# EAGLE schematic Select-Fire Rapidstrike (EAGLE 9.4.2)

## Sheet 1 of 2
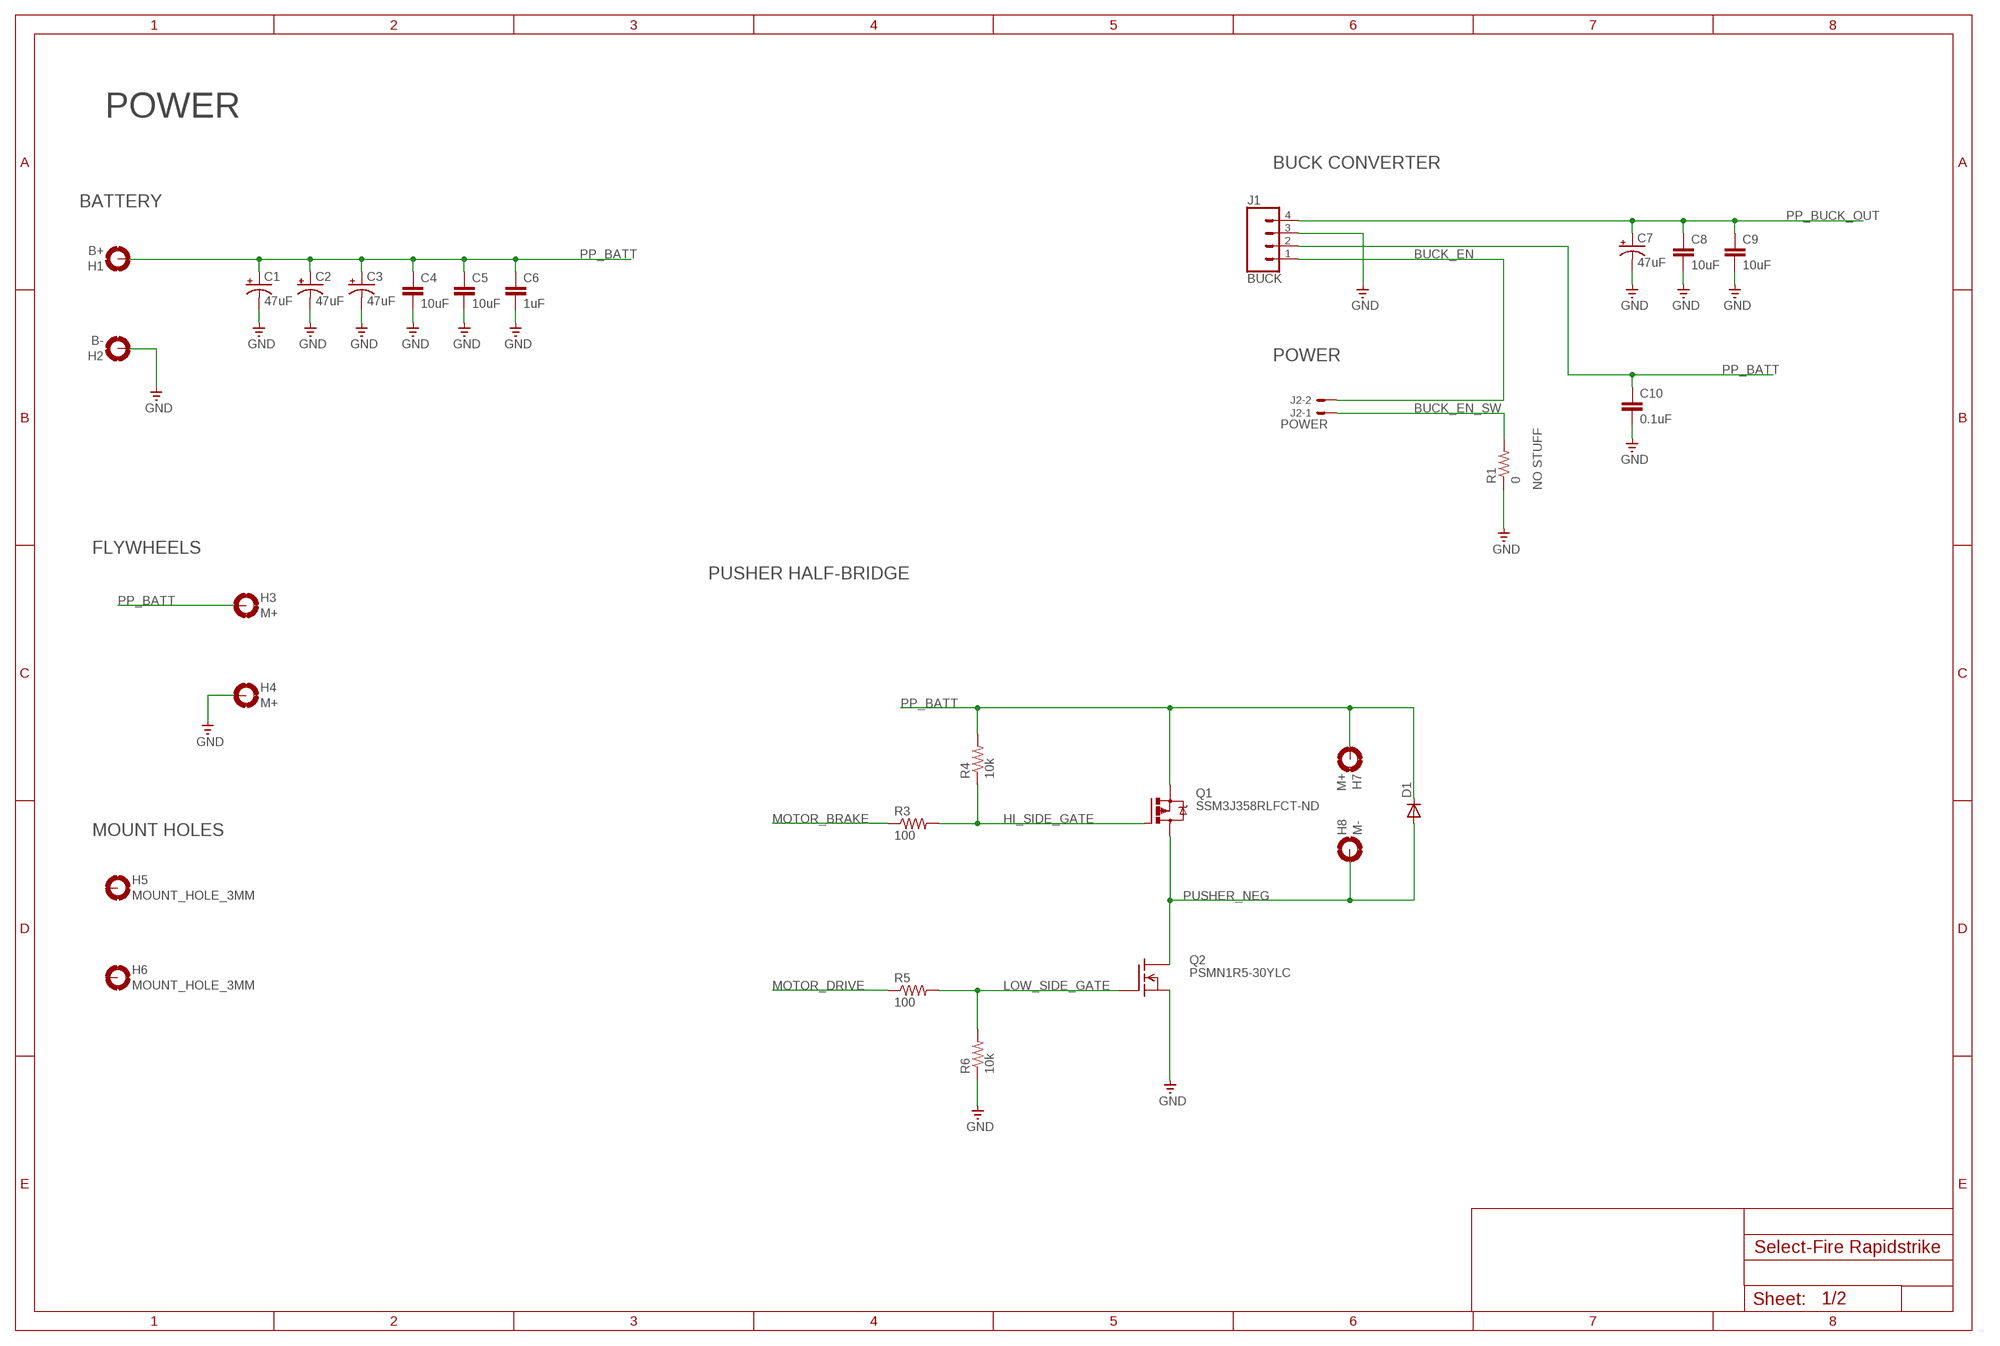
[diagram p0: schematic, sheet 1]

### Parts
C1  47uF  CPOL-USE2-5  [E2-5]
C2  47uF  CPOL-USE2-5  [E2-5]
C3  47uF  CPOL-USE2-5  [E2-5]
C4  10uF  CC1206  [C1206]
C5  10uF  CC1206  [C1206]
C6  1uF  C-EUC0805  [C0805]
C7  47uF  CPOL-USE2-5  [E2-5]
C8  10uF  CC1206  [C1206]
C9  10uF  CC1206  [C1206]
C10  0.1uF  C-EUC0805  [C0805]
D1  S2A  [DO214AA]
H1  B+  MOUNT-HOLE-2.5MM  [MOUNT-HOLE-2.5MM]
H2  B-  MOUNT-HOLE-2.5MM  [MOUNT-HOLE-2.5MM]
H3  M+  MOUNT-HOLE-2.5MM  [MOUNT-HOLE-2.5MM]
H4  M+  MOUNT-HOLE-2.5MM  [MOUNT-HOLE-2.5MM]
H5  MOUNT_HOLE_3MM  [MOUNT_HOLE_3MM]
H6  MOUNT_HOLE_3MM  [MOUNT_HOLE_3MM]
H7  M+  MOUNT-HOLE-2.5MM  [MOUNT-HOLE-2.5MM]
H8  M-  MOUNT-HOLE-2.5MM  [MOUNT-HOLE-2.5MM]
J1  BUCK  CONN_04  [1X04]
J2  POWER  JST-XH-02-PIN-LONG-PAD  [JST-XH-02-PACKAGE-LONG-PAD]
Q1  SSM3J358RLFCT-ND  MOSFET-P-SOT23  [SOT-23]
Q2  PSMN1R5-30YLC  [TO127P600X120-5N]
R1  0  R-US_M0805  [M0805]
R3  100  R-US_M0805  [M0805]
R4  10k  R-US_M0805  [M0805]
R5  100  R-US_M0805  [M0805]
R6  10k  R-US_M0805  [M0805]

### Nets
BUCK_EN: J1.1 J2.2
BUCK_EN_SW: J2.1 R1.2
GND: C1.- C2.- C3.- C4.2 C5.2 C6.2 C7.- C8.2 C9.2 C10.2 H2.P$1(MOUNT) H4.P$1(MOUNT) J1.3 Q2.1(S) Q2.2(S) Q2.3(S) R1.1 R6.1 ; also sheet 2
HI_SIDE_GATE: Q1.1(G) R3.2 R4.1
LOW_SIDE_GATE: Q2.4(G) R5.2 R6.2
MOTOR_BRAKE: R3.1 ; also sheet 2
MOTOR_DRIVE: R5.1 ; also sheet 2
PP_BATT: C1.+ C2.+ C3.+ C4.1 C5.1 C6.1 C10.1 D1.C H1.P$1(MOUNT) H3.P$1(MOUNT) H7.P$1(MOUNT) J1.2 Q1.2(S) R4.2 ; also sheet 2
PP_BUCK_OUT: C7.+ C8.1 C9.1 J1.4 ; also sheet 2
PUSHER_NEG: D1.A H8.P$1(MOUNT) Q1.3(D) Q2.5(D)
Unconnected: H5.P$1(MOUNT) H6.P$1(MOUNT)

### Notes on the sheet
- POWER
- BUCK CONVERTER
- BATTERY
- POWER
- NO STUFF
- FLYWHEELS
- PUSHER HALF-BRIDGE
- MOUNT HOLES

## Sheet 2 of 2
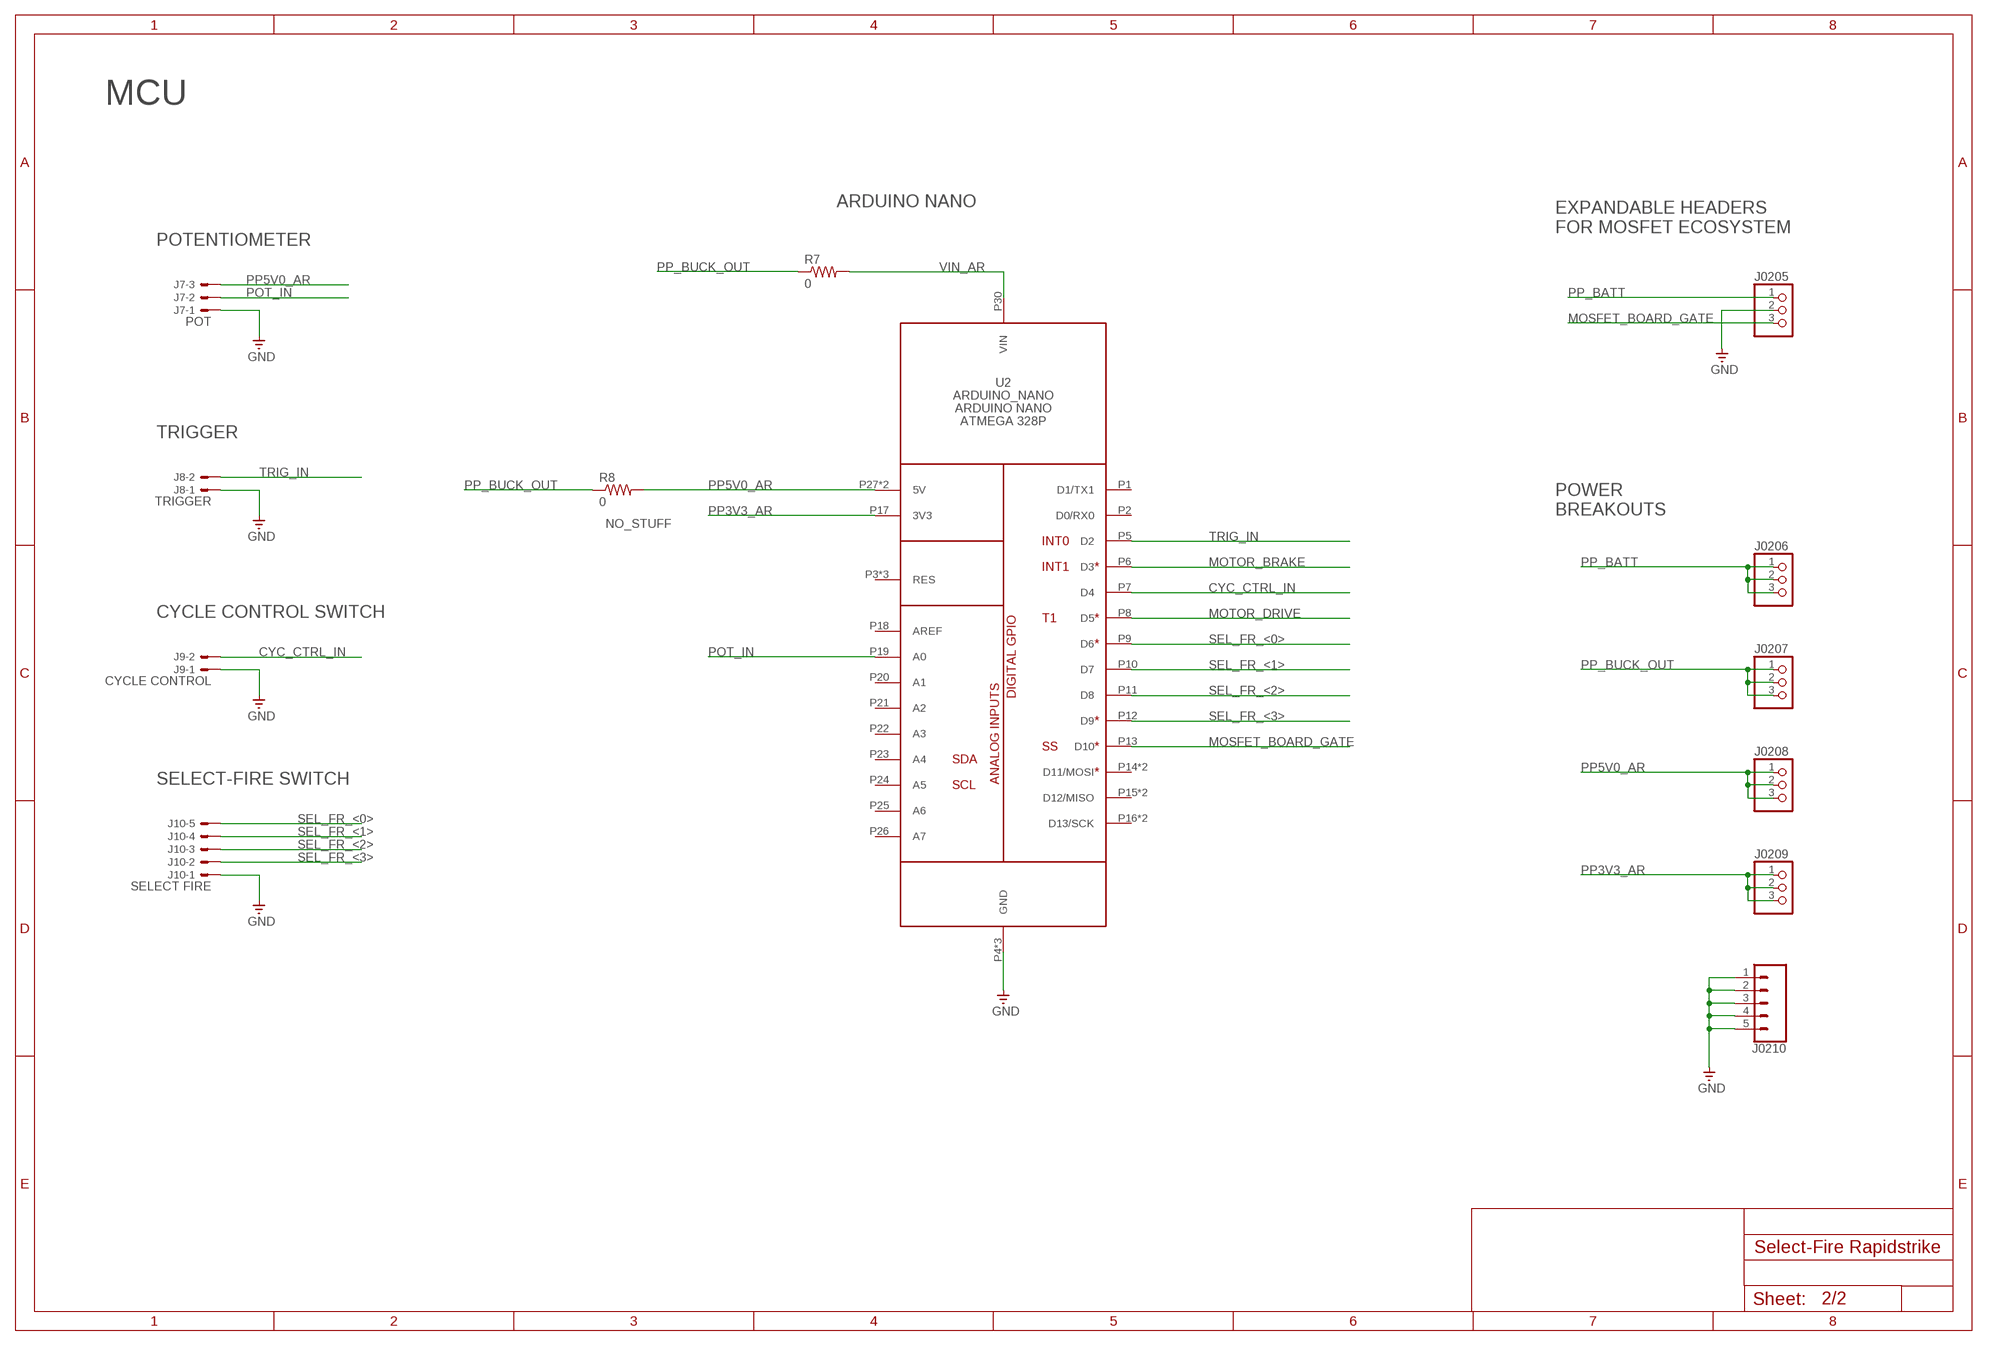
[diagram p1: schematic, sheet 2]

### Parts
J7  POT  JST-XH-03-PIN-LONG-PAD  [JST-XH-03-PACKAGE-LONG-PAD]
J8  TRIGGER  JST-XH-02-PIN-LONG-PAD  [JST-XH-02-PACKAGE-LONG-PAD]
J9  CYCLE CONTROL  JST-XH-02-PIN-LONG-PAD  [JST-XH-02-PACKAGE-LONG-PAD]
J10  SELECT FIRE  JST-XH-05-PIN-LONG-PAD  [JST-XH-05-PACKAGE-LONG-PAD]
J0205  PINHD-1X3  [1X03]
J0206  PINHD-1X3  [1X03]
J0207  PINHD-1X3  [1X03]
J0208  PINHD-1X3  [1X03]
J0209  PINHD-1X3  [1X03]
J0210  CONN_05  [1X05]
R7  0  R-US_M0805  [M0805]
R8  0  R-US_M0805  [M0805]
U2  ARDUINO_NANO  [ARDUINO_NANO]

### Nets
CYC_CTRL_IN: J9.2 U2.P7(D4)
GND: J7.1 J8.1 J9.1 J10.1 J0205.2 J0210.1 J0210.2 J0210.3 J0210.4 J0210.5 U2.P4(GND) U2.P29(GND) U2.P32(GND) ; also sheet 1
MOSFET_BOARD_GATE: J0205.3 U2.P13(D10)
MOTOR_BRAKE: U2.P6(D3) ; also sheet 1
MOTOR_DRIVE: U2.P8(D5) ; also sheet 1
POT_IN: J7.2 U2.P19(A0)
PP3V3_AR: J0209.1 J0209.2 J0209.3 U2.P17(3V3)
PP5V0_AR: J7.3 J0208.1 J0208.2 J0208.3 R8.2 U2.P27(5V) U2.P36(5V)
PP_BATT: J0205.1 J0206.1 J0206.2 J0206.3 ; also sheet 1
PP_BUCK_OUT: J0207.1 J0207.2 J0207.3 R7.1 R8.1 ; also sheet 1
SEL_FR_<0>: J10.5 U2.P9(D6)
SEL_FR_<1>: J10.4 U2.P10(D7)
SEL_FR_<2>: J10.3 U2.P11(D8)
SEL_FR_<3>: J10.2 U2.P12(D9)
TRIG_IN: J8.2 U2.P5(D2)
VIN_AR: R7.2 U2.P30(VIN)
Unconnected: U2.P1(D1/TX1) U2.P2(D0/RX0) U2.P3(RES) U2.P14(D11/MOSI) U2.P15(D12/MISO) U2.P16(D13/SCK) U2.P18(AREF) U2.P20(A1) U2.P21(A2) U2.P22(A3) U2.P23(A4) U2.P24(A5) U2.P25(A6) U2.P26(A7) U2.P28(RES) U2.P31(RES) U2.P33(D13/SCK) U2.P34(D11/MOSI) U2.P35(D12/MISO)

### Notes on the sheet
- MCU
- ARDUINO NANO
- EXPANDABLE HEADERS 
  FOR MOSFET ECOSYSTEM
- POTENTIOMETER
- TRIGGER
- POWER 
  BREAKOUTS
- CYCLE CONTROL SWITCH
- SELECT-FIRE SWITCH

## Library data of the parts
C1-C3 C7 = adafruit:CPOL-US: POLARIZED CAPACITOR, American symbol
C4 C5 C8 C9 = eagle-ltspice:C: CAPACITOR, European symbol; SPICEMODEL: NONE; SPICEPREFIX: C
C6 C10 = rcl:C-EU: CAPACITOR, European symbol; SPICEPREFIX: C
D1 = s2x_10:S2*: S2A - S2M General Purpose Rectifiers Source: http://www.fairchildsemi.com/datasheets/S2/S2A.pdf; MF: Fairchild; MPN: S2A; OC_FARNELL: 1467485; OC_NEWARK: 58K2391
H1-H4 H7 H8 = my-eagle-lib:MOUNT-HOLE-2.5MM: Mount hole, 2.5mm inner diameter. Fits 14awg wiring great, 16awg a bit tight. Used in MOSFET board kit v1.2.
H5 H6 = my-eagle-lib:MOUNT_HOLE_3MM: Mount hole with 3mm inner diameter. Should be good for Nerf screws, will test that in Select-fire Rapidstrik p0.1 board MLB.
J1 = SparkFun-Connectors:CONN_04: Multi connection point. Often used as Generic Header-pin footprint for 0.1 inch spaced/style header connections On any of the 0.1 inch spaced packages, you can populate with these: Break Away Headers - Straight <https://www.sparkfun.com/products/116> (PRT-00116) Break Away Male Headers - Right Angle <https://www.sparkfun.com/products/553> (PRT-00553) Female Headers <https://www.sparkfun.com/products/115> (PRT-00115) Break Away Headers - Machine Pin <https://www.sparkfun.com/products/117> (PRT-00117) Break Away Female Headers - Swiss Machine Pin <https://www.sparkfun.com/products/743> (PRT-00743) For SCREWTERMINALS and SPRING TERMINALS visit here: Screw Terimnals on SparkFun.com <https://www.sparkfun.com/search/results?term=Screw+Terminals> (5mm/3.5mm/2.54mm spacing) This device is also useful as a general connection point to wire up your design to another part of your project. Our various solder wires solder well into these plated through hole pads. Hook-Up Wire - Assortment (Stranded, 22 AWG) <https://www.sparkfun.com/products/11375> (PRT-11375) Hook-Up Wire - Assortment (Solid Core, 22 AWG) <https://www.sparkfun.com/products/11367> (PRT-11367) View the entire wire category on our website here <https://www.sparkfun.com/categories/141> Special notes: Molex polarized connector foot print use with SKU : PRT-08231 with associated crimp pins and housings. 1MM SMD Version SKU: PRT-10208; PROD_ID: CONN-09696
J2 J8 J9 = Rembrandt Electronics - JST XH Connectors v1-0:JST-XH-02-PIN: JST XH Connector 2 Pin Wire to board connector. Pitch: 2,54 mm, (0.100") Number of pins: 2 Created by Rembrandt Electronics www.rembrandtelectronics.com
J7 = Rembrandt Electronics - JST XH Connectors v1-0:JST-XH-03-PIN: JST XH Connector 2 Pin Wire to board connector. Pitch: 2,54 mm, (0.100") Number of pins: 3 Created by Rembrandt Electronics www.rembrandtelectronics.com
J10 = Rembrandt Electronics - JST XH Connectors v1-0:JST-XH-05-PIN: JST XH Connector 2 Pin Wire to board connector. Pitch: 2,54 mm, (0.100") Number of pins: 5 Created by Rembrandt Electronics www.rembrandtelectronics.com
J0205-J0209 = adafruit:PINHD-1X3: PIN HEADER
J0210 = SparkFun-Connectors:CONN_05: Multi connection point. Often used as Generic Header-pin footprint for 0.1 inch spaced/style header connections On any of the 0.1 inch spaced packages, you can populate with these: Break Away Headers - Straight <https://www.sparkfun.com/products/116> (PRT-00116) Break Away Male Headers - Right Angle <https://www.sparkfun.com/products/553> (PRT-00553) Female Headers <https://www.sparkfun.com/products/115> (PRT-00115) Break Away Headers - Machine Pin <https://www.sparkfun.com/products/117> (PRT-00117) Break Away Female Headers - Swiss Machine Pin <https://www.sparkfun.com/products/743> (PRT-00743) For SCREWTERMINALS and SPRING TERMINALS visit here: Screw Terimnals on SparkFun.com <https://www.sparkfun.com/search/results?term=Screw+Terminals> (5mm/3.5mm/2.54mm spacing) This device is also useful as a general connection point to wire up your design to another part of your project. Our various solder wires solder well into these plated through hole pads. Hook-Up Wire - Assortment (Stranded, 22 AWG) <https://www.sparkfun.com/products/11375> (PRT-11375) Hook-Up Wire - Assortment (Solid Core, 22 AWG) <https://www.sparkfun.com/products/11367> (PRT-11367) View the entire wire category on our website here <https://www.sparkfun.com/categories/141> Special notes: Molex polarized connector foot print use with SKU : PRT-08231 with associated crimp pins and housings. 1MM SMD Version SKU: PRT-10208
Q1 = bt_transistor:MOSFET-P: P-Channel MOSFET with integrated body diode
Q2 = my-eagle-lib:PSMN1R5-30YLC: PSMN1R5-30YLC N-Channel Power MOSFET 30V, 100A, 1.55mΩ logic level MOSFET, surface-mount SOT669 package Datasheet <https://assets.nexperia.com/documents/data-sheet/PSMN1R5-30YLC.pdf> DigiKey Buy Link <https://www.digikey.com/product-detail/en/nexperia-usa-inc/PSMN1R5-30YLC115/1727-5297-1-ND/2674291> Package stolen from here <https://www.mikrocontroller.net/topic/236049> Symbol stolen from here <https://github.com/adafruit/Adafruit-Eagle-Library>
R1 R3-R7 = adafruit:R-US_: RESISTOR, American symbol
R8 = adafruit:R-US_: RESISTOR, American symbol; STUFF: NO_STUFF
U2 = my-eagle-lib:ARDUINO_NANO